# EAGLE design dual 5v (EAGLE 9.6.2)
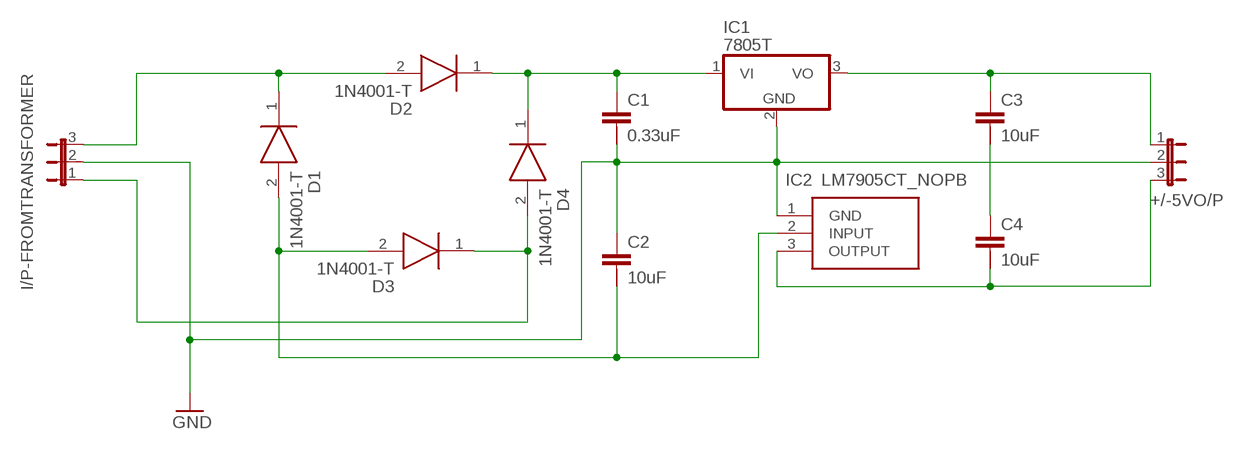
[diagram p0: schematic, sheet 1]

## Parts
+/-5VO/P  JP2E  [JP2]
C1  0.33uF  C-2.5-5/2  [C2.5/5-2]
C2  10uF  C-2.5-5/2  [C2.5/5-2]
C3  10uF  C-2.5-5/2  [C2.5/5-2]
C4  10uF  C-2.5-5/2  [C2.5/5-2]
D1  1N4001-T  [DIOAD1408W86L464D236]
D2  1N4001-T  [DIOAD1408W86L464D236]
D3  1N4001-T  [DIOAD1408W86L464D236]
D4  1N4001-T  [DIOAD1408W86L464D236]
I/P-FROMTRANSFORMER  JP2E  [JP2]
IC1  7805T  [TO220H]
IC2  LM7905CT_NOPB  [TO254P470X1028X1955-3P]

## Nets
GND: +/-5VO/P.2 C1.2 C2.1 I/P-FROMTRANSFORMER.2 IC1.2(GND) IC2.1(GND)
N$1: D1.1(K) D2.2(A) I/P-FROMTRANSFORMER.3
N$2: C1.1 D2.1(K) D4.1(K) IC1.1(VI)
N$3: C2.2 D1.2(A) D3.2(A) IC2.2(INPUT)
N$5: +/-5VO/P.3 C4.2 IC2.3(OUTPUT)
N$6: D3.1(K) D4.2(A) I/P-FROMTRANSFORMER.1
N$7: +/-5VO/P.1 C3.1 IC1.3(VO)
N$8: C3.2 C4.1
Unconnected: C1.3 C2.3 C3.3 C4.3

## Library data of the parts
+/-5VO/P I/P-FROMTRANSFORMER = jumper:JP2E: JUMPER
C1-C4 = capacitor-wima:C-: CAPACITOR for alternative placement naming: default grid - extended grid/package width
D1-D4 = 1N4001-T:1N4001-T: Diode Switching 50V 1A 2Pin DO41 Diodes Inc 1N4001-T Switching Diode, 1A 50V, 2-Pin DO-41 Source: Datasheet <http://www.diodes.com/_files/datasheets/ds29002.pdf>; ARROW_PART_NUMBER: 1N4001-T; ARROW_PRICE-STOCK: https://www.arrow.com/en/products/1n4001-t/diodes-incorporated; DESCRIPTION: Diode Switching 50V 1A 2Pin DO41 Diodes Inc 1N4001-T Switching Diode, 1A 50V, 2-Pin DO-41; HEIGHT: mm; MANUFACTURER_NAME: Diodes Inc.; MANUFACTURER_PART_NUMBER: 1N4001-T; MOUSER_PART_NUMBER: 621-1N4001; MOUSER_PRICE-STOCK: https://www.mouser.co.uk/ProductDetail/Diodes-Incorporated/1N4001-T?qs=e%2FRqmsgwm9i%2FVrrtazegeg%3D%3D
IC1 = linear:78*: Positive VOLTAGE REGULATOR Source: http://cache.national.com/ds/LM/LM78L05.pdf http://www.fairchildsemi.com/ds/LM/LM7805.pdf
IC2 = LM7905CT_NOPB:LM7905CT_NOPB: Voltage regulator,LM7905CT -5V Texas Instruments LM7905CT/NOPB, Single Negative Voltage Regulator 1.5A -5 V, +/-4%, 3-Pin TO-220 Source: Datasheet <http://www.ti.com/lit/gpn/lm7905>; ARROW_PART_NUMBER: LM7905CT/NOPB; ARROW_PRICE-STOCK: https://www.arrow.com/en/products/lm7905ctnopb/texas-instruments; DESCRIPTION: Voltage regulator,LM7905CT -5V Texas Instruments LM7905CT/NOPB, Single Negative Voltage Regulator 1.5A -5 V, +/-4%, 3-Pin TO-220; HEIGHT: 4.7mm; MANUFACTURER_NAME: Texas Instruments; MANUFACTURER_PART_NUMBER: LM7905CT/NOPB; MOUSER_PART_NUMBER: 926-LM7905CT/NOPB; MOUSER_PRICE-STOCK: https://www.mouser.co.uk/ProductDetail/Texas-Instruments/LM7905CT-NOPB?qs=QbsRYf82W3EUyxHaqeuxKA%3D%3D

## Board
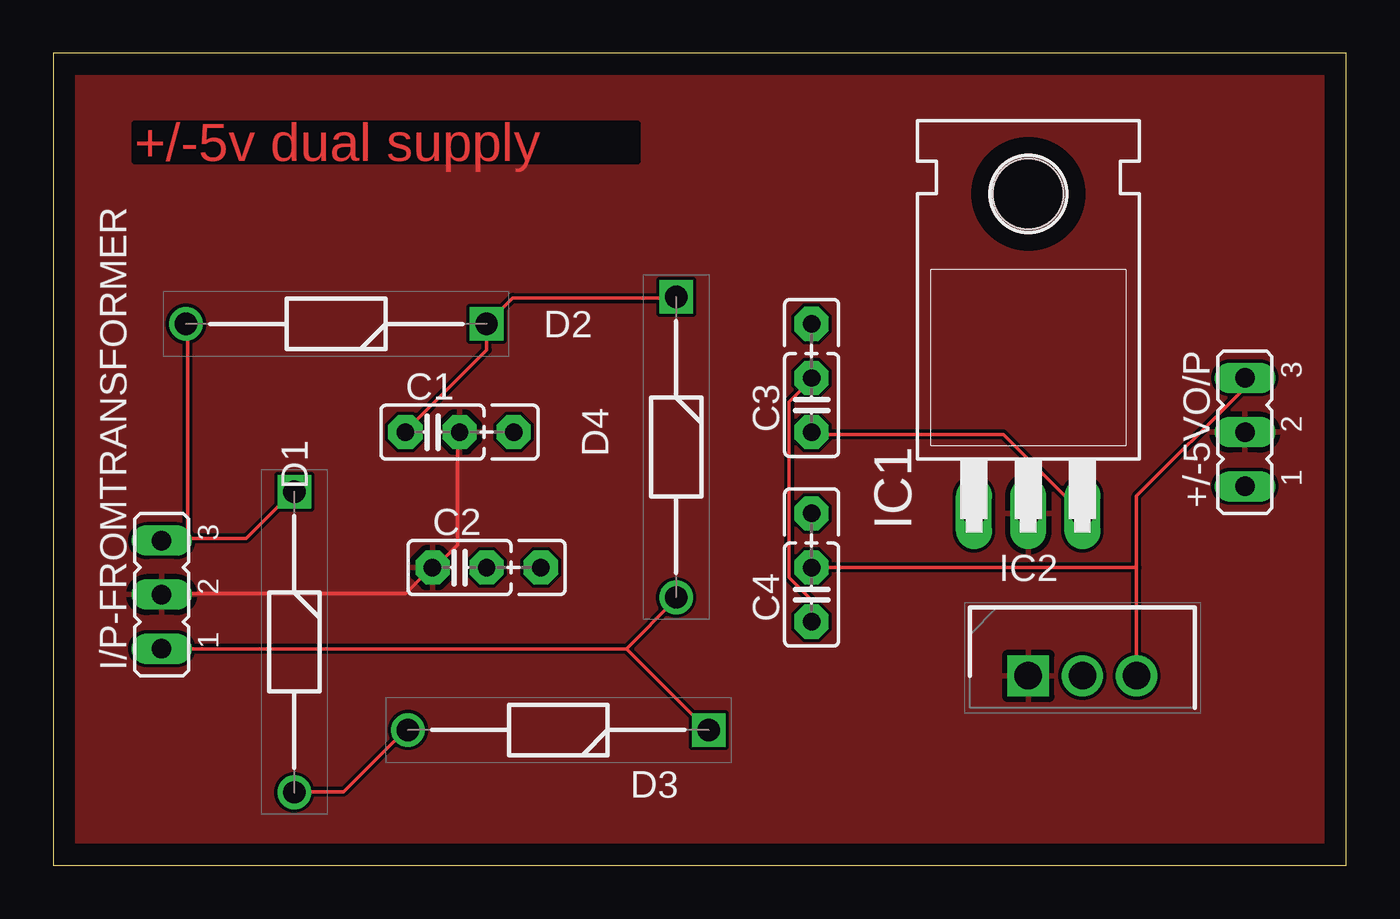
[diagram p1: board, top side]
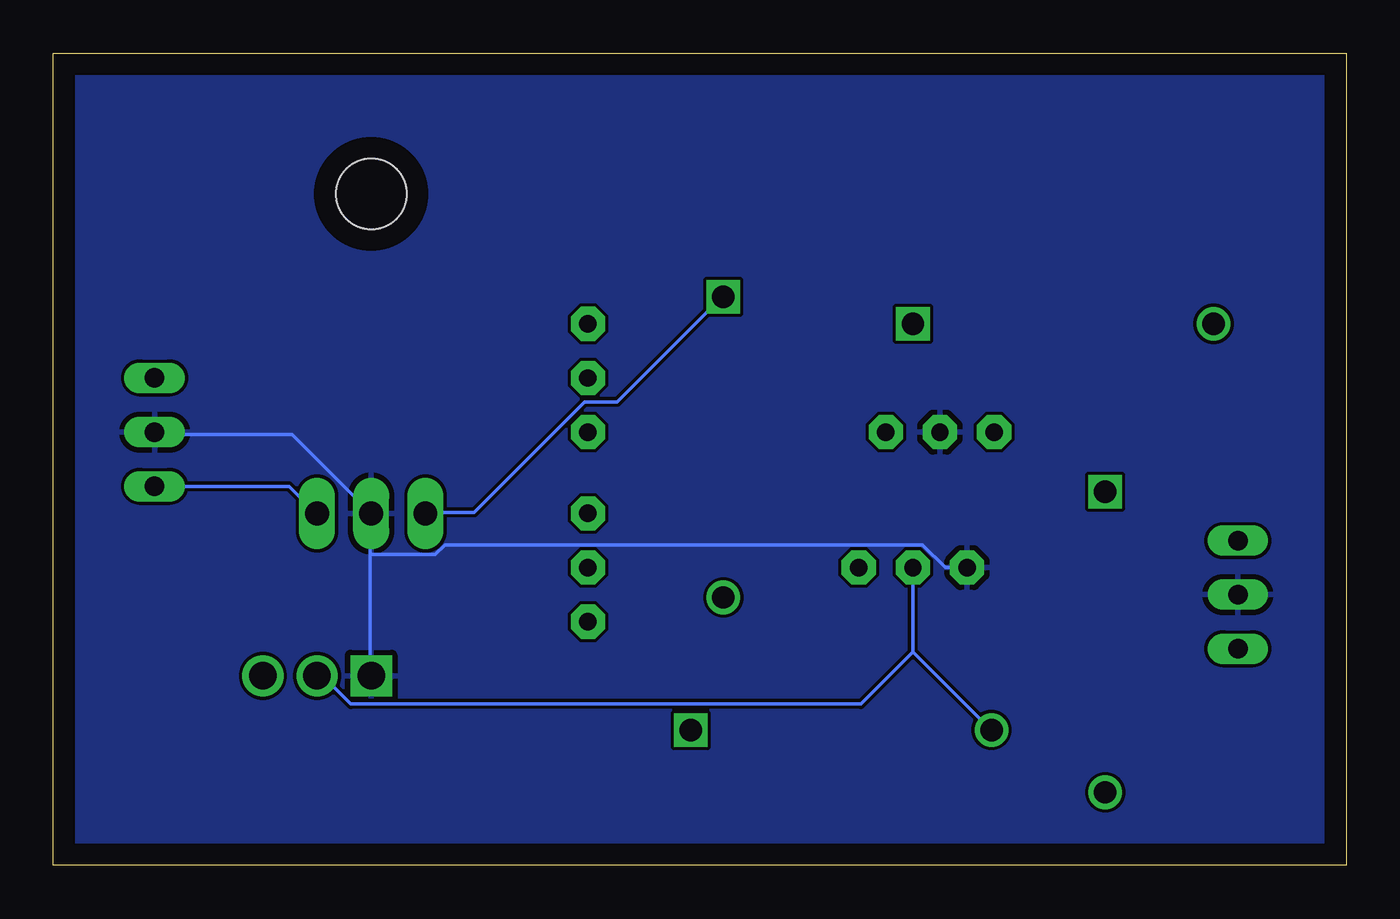
[diagram p2: board, bottom side, seen from below]

Size 60.63 x 38.09 mm. Coordinates in mm from the lower left corner, seen from the top.
Outline: 0,0 60.63,0 60.63,38.09 0,38.09 0,0
Copper layers (1*16): Top 0.035mm / dielectric 1.5mm / Bottom 0.035mm
Design rules "default": minimum track width 6mil, minimum drill 0.35mm, track to track 6mil, track to pad 6mil, pad to pad 6mil, via to via 6mil, smd to smd 6mil, copper to edge 40mil, drill to drill 6mil, minimum pad ring 10mil, minimum via ring 8mil, stop-mask expansion 4mil, vias tented up to drill 0mil, thermal gap 10mil

### Footprints (pad centres in the part's own frame; a part is rotated, then mirrored left to right if it is on the bottom)
JP2 = drill 0.914 long: 1 -2.54,0; 2 0,0; 3 2.54,0
C2.5/5-2 = drill 0.813 pad 1.6 octagon: 1 -1.27,0; 2 1.27,0; 3 3.81,0
DIOAD1408W86L464D236 = drill 1.05 pad 1.575 square: 1 0,0 | drill 1.05 pad 1.575: 2 14.1,0
TO220H = drill 1.118 long: 1 -2.54,-10.16; 2 0,-10.16; 3 2.54,-10.16 | hole 3.302: 0,4.826
TO254P470X1028X1955-3P = drill 1.29 pad 1.935 square: 1 0,0 | drill 1.29 pad 1.935: 2 2.54,0; 3 5.08,0

### Placement (x,y rotation side)
+/-5VO/P  55.88,20.32 90 top
C1  17.78,20.32 0 top
C2  19.05,13.97 0 top
C3  35.56,21.59 90 top
C4  35.56,12.7 90 top
D1  11.3,17.53 270 top
D2  20.32,25.4 180 top
D3  30.73,6.35 180 top
D4  29.21,26.67 270 top
I/P-FROMTRANSFORMER  5.08,12.7 90 top
IC1  45.72,26.67 0 top
IC2  45.72,8.89 0 top

### Tracks (layer width: path | path; a pad name or v marks a point on that pad's centre or on a via)
GND
  Top 0.152: I/P-FROMTRANSFORMER.2 5.08,12.75 16.51,12.75 17.73,13.97 C2.1 17.88,13.97 18.95,15.04 18.95,20.22 C1.2
  Bottom 0.152: +/-5VO/P.2 55.83,20.22 49.43,20.22 IC1.2 45.77,16.41 45.77,14.58 | 45.77,14.58 45.77,8.94 IC2.1 | C2.1 18.8,13.97 19.86,15.04 42.27,15.04 42.72,14.58 45.77,14.58
  pour Top: -1.27,38.1 -1.27,-1.27 62.23,-1.27 62.23,38.1 60.96,39.37 0,39.37
  pour Bottom: -2.54,-1.27 -2.54,38.1 0,40.64 60.96,40.64 63.5,38.1 63.5,-1.27 63.5,-2.54 -1.27,-2.54
N$1
  Top 0.152: 6.3,15.34 9.04,15.34 11.18,17.48 D1.1 | 6.3,15.34 5.08,15.34 I/P-FROMTRANSFORMER.3 6.3,15.34 | 6.3,15.34 6.3,25.4 D2.2
N$2
  Top 0.152: C1.1 16.51,20.37 20.32,24.18 D2.1 21.54,26.62 29.16,26.62 D4.1
  Bottom 0.152: IC1.1 43.18,16.56 40.89,16.56 35.71,21.74 34.19,21.74 29.31,26.62 D4.1
N$3
  Top 0.152: D1.2 11.33,3.45 13.61,3.45 16.51,6.35 D3.2
  Bottom 0.152: 20.32,10.01 C2.2 | 20.32,10.01 16.66,6.35 D3.2 | 20.32,10.01 22.76,7.57 46.69,7.57 47.9,8.79 48.21,8.79 IC2.2
N$5
  Top 0.152: IC2.3 50.8,13.97 | 50.8,13.97 50.8,17.32 55.83,22.35 55.83,22.81 +/-5VO/P.3 | 50.8,13.97 C4.2
N$6
  Top 0.152: 26.87,10.16 I/P-FROMTRANSFORMER.1 | 26.87,10.16 29.16,12.45 D4.2 | 26.87,10.16 30.68,6.35 D3.1
N$7
  Top 0.152: IC1.3 44.55,20.22 35.56,20.22 C3.1
  Bottom 0.152: +/-5VO/P.1 49.58,17.78 48.36,16.56 IC1.3
N$8
  Top 0.152: C4.1 35.56,12.45 34.49,13.51 34.49,21.74 35.56,22.81 C3.2

### Text on the board
Top: +/-5v dual supply